# EasyEDA Pro project CameraTargetV1.eprj, schematic Schematic1
Create Date: 2023-02-02; Page Name: P1; Project Name: CameraTargetV1; Schematic Name: Schematic1; Update Date: 2023-06-21
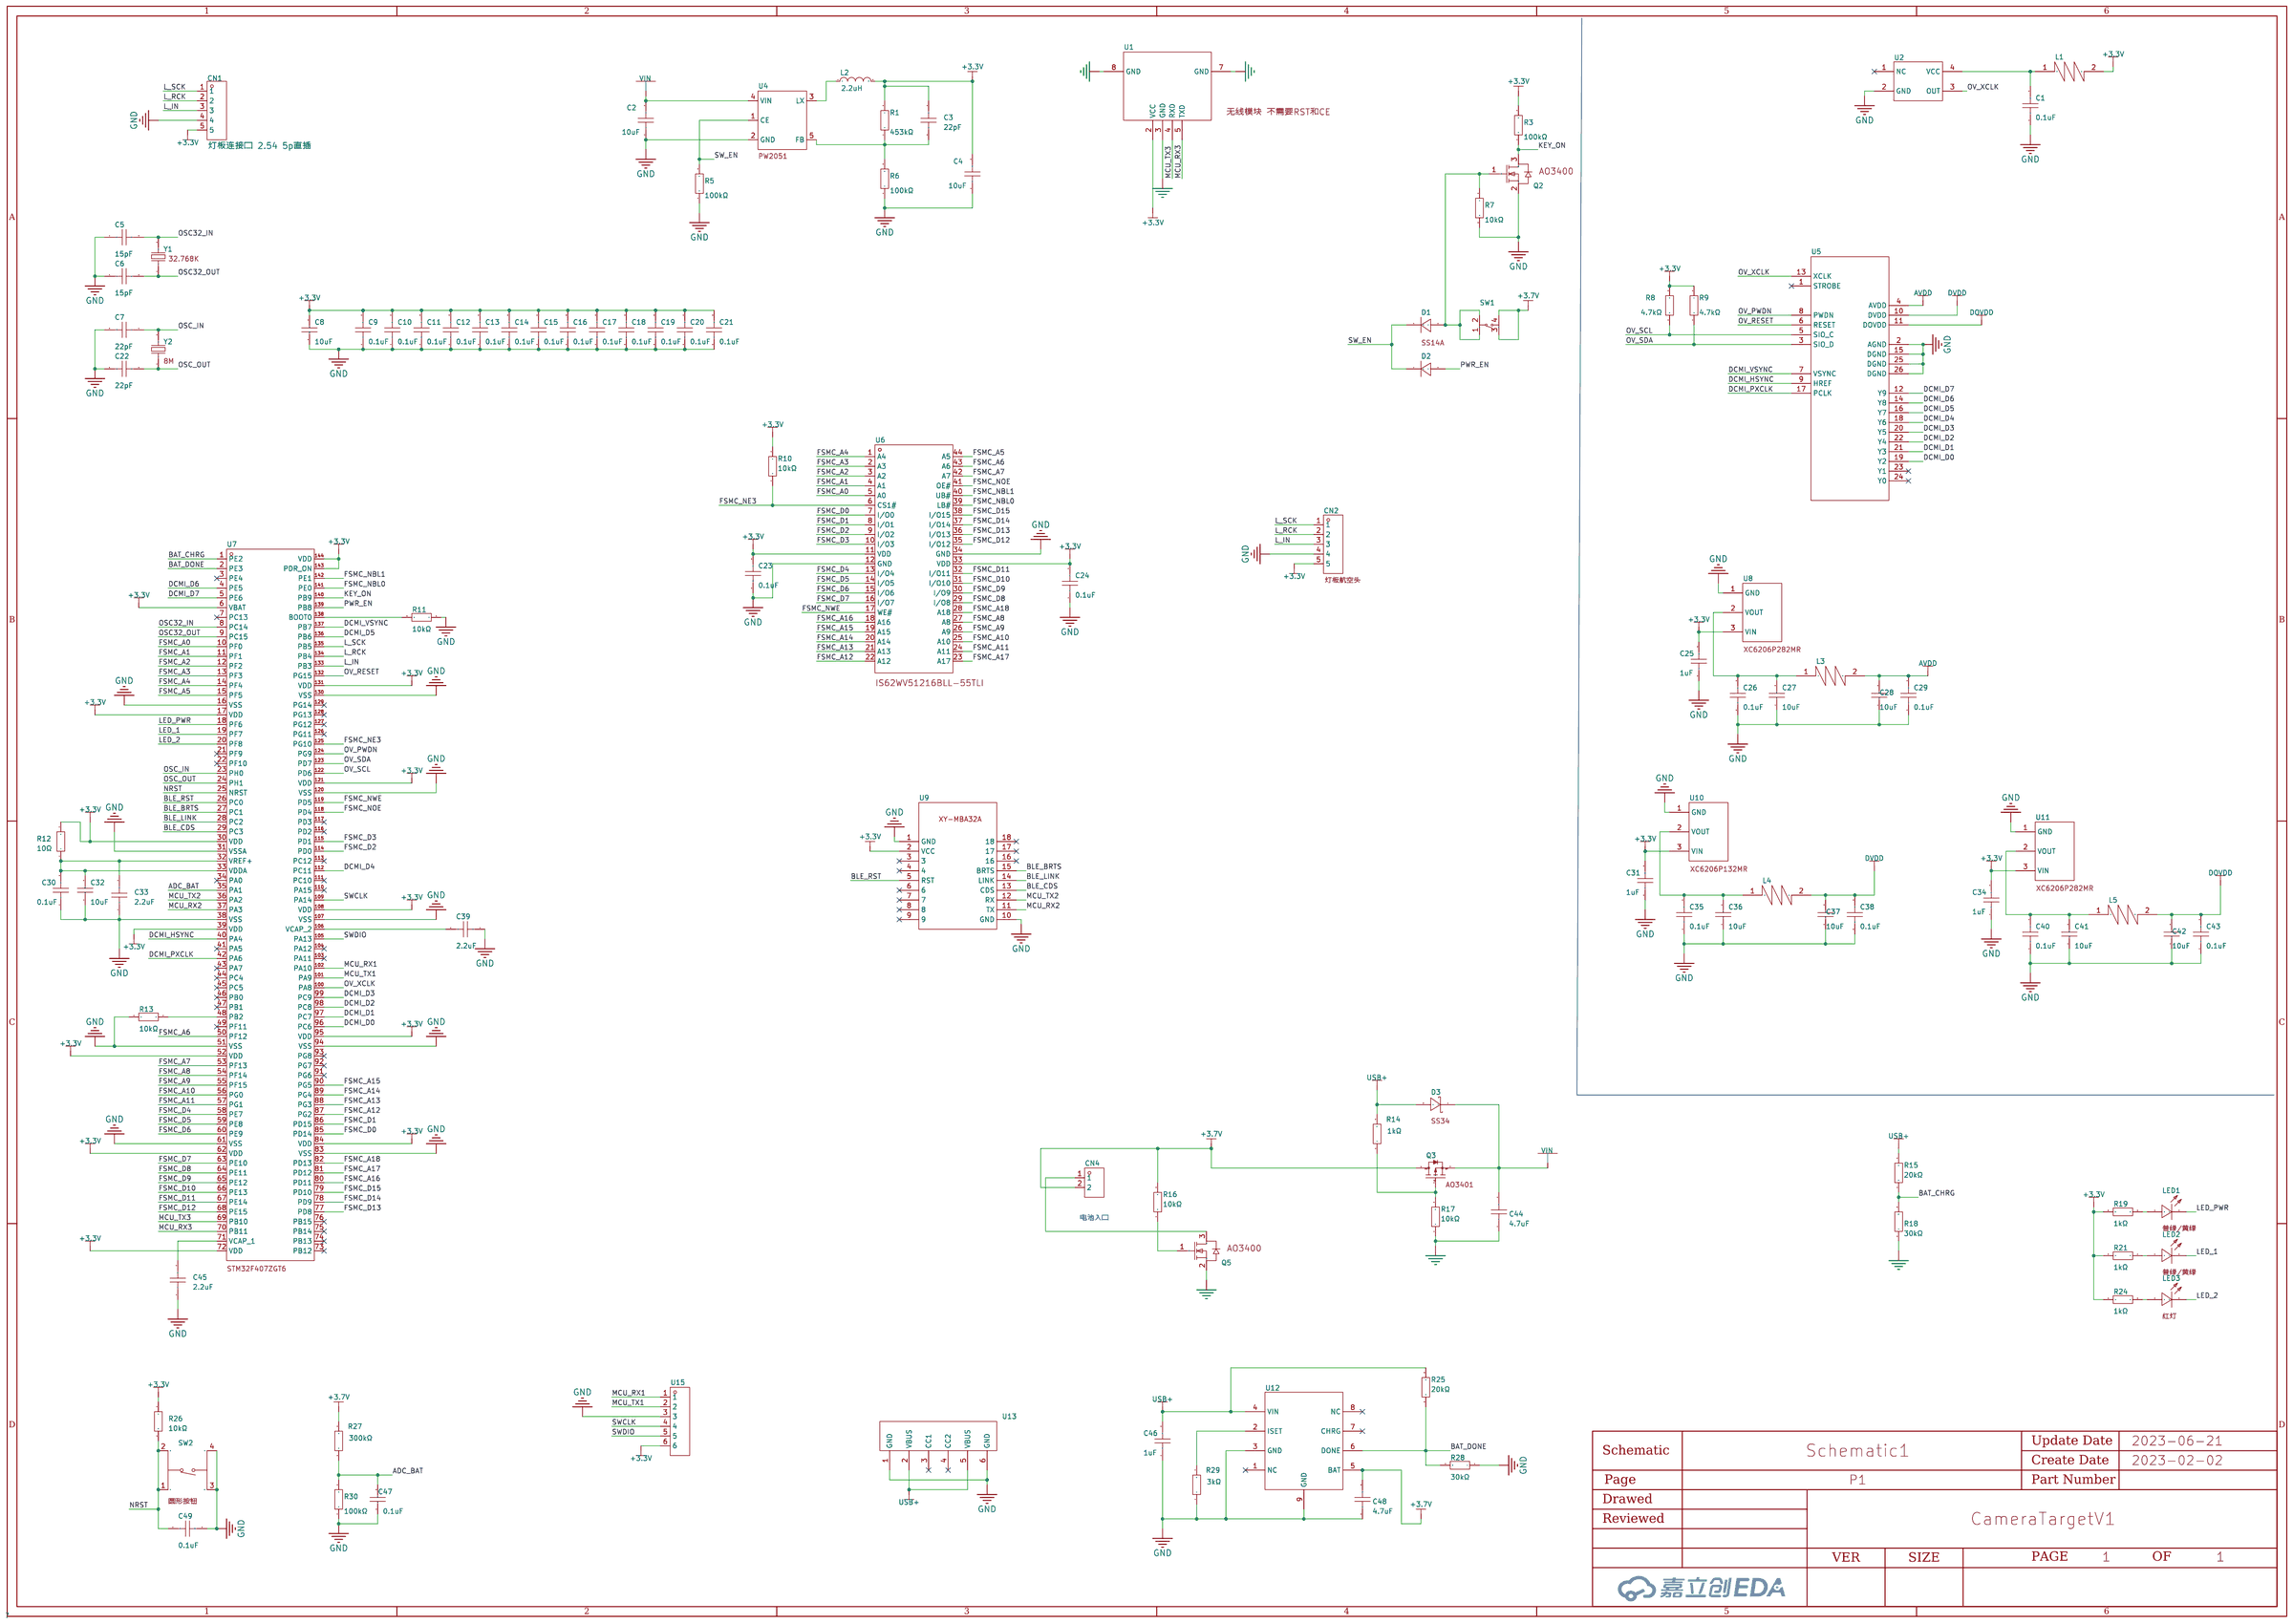
[diagram p0: schematic sheet]

## Parts
C1  0.1uF  [C0603]
C2  10uF  [C0603]
C3  22pF  [C0603]
C4  10uF  [C0603]
C5  15pF  [C0603]
C6  15pF  [C0603]
C7  22pF  [C0603]
C8  10uF  [C0603]
C9  0.1uF  [C0603]
C10  0.1uF  [C0603]
C11  0.1uF  [C0603]
C12  0.1uF  [C0603]
C13  0.1uF  [C0603]
C14  0.1uF  [C0603]
C15  0.1uF  [C0603]
C16  0.1uF  [C0603]
C17  0.1uF  [C0603]
C18  0.1uF  [C0603]
C19  0.1uF  [C0603]
C20  0.1uF  [C0603]
C21  0.1uF  [C0603]
C22  22pF  [C0603]
C23  0.1uF  [C0603]
C24  0.1uF  [C0603]
C25  1uF  [C0603]
C26  0.1uF  [C0603]
C27  10uF  [C0603]
C28  10uF  [C0603]
C29  0.1uF  [C0603]
C30  0.1uF  [C0603]
C31  1uF  [C0603]
C32  10uF  [C0603]
C33  2.2uF  [C0603]
C34  1uF  [C0603]
C35  0.1uF  [C0603]
C36  10uF  [C0603]
C37  10uF  [C0603]
C38  0.1uF  [C0603]
C39  2.2uF  [C0603]
C40  0.1uF  [C0603]
C41  10uF  [C0603]
C42  10uF  [C0603]
C43  0.1uF  [C0603]
C44  4.7uF  [C0603]
C45  2.2uF  [C0603]
C46  1uF  [C0603]
C47  0.1uF  [C0603]
C48  4.7uF  [C0603]
C49  0.1uF  [C0603]
CN1  灯板连接口 2.54 5p直插  [CONN-TH_5P-P2.50_HX25003-5A]
CN2  HDGC2501WR-5P  [CONN-TH_5P-P2.50_HDGC2501WR-5P]
CN4  HDGC2501WR-2P  [CONN-TH_2P-P2.50_HDGC2501WR-2P]
D1  SS14A  [SMA_L4.3-W2.6-LS5.2-RD]
D2  SS14A  [SMA_L4.3-W2.6-LS5.2-RD]
D3  -  [DO-214AC_L4.3-W2.7-LS5.3-RD]
L1  -  [0420]
L2  2.2uH  [IND-SMD_L4.0-W4.0_0.47UH04209.5A]
L3  -  [0420]
L4  -  [0420]
L5  -  [0420]
LED1  TLMG1100-GS08  [LED0603-R-RD_GREEN]
LED2  TLMG1100-GS08  [LED0603-R-RD_GREEN]
LED3  TLMS1000-GS08  [LED0603-R-RD]
Q2  AO3400  [SOT-23_L2.9-W1.3-P1.90-LS2.4-BR]
Q3  -  [SOT-23-3_L2.9-W1.3-P1.90-LS2.4-BR]
Q5  AO3400  [SOT-23_L2.9-W1.3-P1.90-LS2.4-BR]
R1  453kΩ  [R0603]
R3  100kΩ  [R0603]
R5  100kΩ  [R0603]
R6  100kΩ  [R0603]
R7  10kΩ  [R0603]
R8  4.7kΩ  [R0603]
R9  4.7kΩ  [R0603]
R10  10kΩ  [R0603]
R11  10kΩ  [R0603]
R12  10Ω  [R0603]
R13  10kΩ  [R0603]
R14  1kΩ  [R0603]
R15  20kΩ  [R0603]
R16  10kΩ  [R0603]
R17  10kΩ  [R0603]
R18  30kΩ  [R0603]
R19  1kΩ  [R0603]
R21  1kΩ  [R0603]
R24  1kΩ  [R0603]
R25  20kΩ  [R0603]
R26  10kΩ  [R0603]
R27  300kΩ  [R0603]
R28  30kΩ  [R0603]
R29  3kΩ  [R0603]
R30  100kΩ  [R0603]
SW1  -  [按钮开关]
SW2  1TS001G-2700-1500-CT  [SW-SMD_4P-L5.1-W5.1-P3.70-LS6.5-TL-2]
U1  -  [GC2400-TC010R]
U2  -  [5032-4P]
U4  -  [PW2051]
U5  -  [OV2640]
U6  IS62WV51216BLL-55TLI  [TSOP-44_L18.4-W10.2-P0.80-LS11.8-BL]
U7  STM32F407ZGT6  [LQFP-144_L20.0-W20.0-P0.50-LS22.0-BL]
U8  -  [SOT-23-3_L2.9-W1.6-P1.90-LS2.9-BL]
U9  -  [XY-MBA32A]
U10  -  [SOT-23-3_L2.9-W1.6-P1.90-LS2.9-BL]
U11  -  [SOT-23-3_L2.9-W1.6-P1.90-LS2.9-BL]
U12  -  [PW4056]
U13  -  [typec]
U15  HDGC1501WV-6P  [CONN-TH_6P-P1.50_HDGC_HDGC1501WV-6P]
Y1  -  [3215]
Y2  -  [5032]

## Library data of the parts
C1 C9-C21 C23 C24 C26 C29 C30 C35 C38 C40 C43 C49 = CC0603KRX7R9BB104: 容值:100nF;精度:±10%;额定电压:50V;材质(温度系数):X7R;; LCSC Part Name: 100nF ±10% 50V; Supplier Part: C14663; Manufacturer: YAGEO(国巨); Supplier Footprint: 0603; JLCPCB Part Class: Basic Part; Datasheet: https://atta.szlcsc.com/upload/public/pdf/source/20170116/1484561234239.pdf; Supplier: LCSC; Tolerance: ±10%; Voltage Rated: 50V; Temperature Coefficient: X7R
C2 C4 = 0603X106M100CT: 容值:10uF;精度:±20%;额定电压:10V;温度系数:X5R;; LCSC Part Name: 10uF ±20% 10V; Supplier Part: C89283; Manufacturer: 华新科(Walsin); Supplier Footprint: 0603; JLCPCB Part Class: Extended Part; Datasheet: https://atta.szlcsc.com/upload/public/pdf/source/20161226/1482720147964.pdf; Supplier: LCSC; Tolerance: ±20%; Voltage Rated: 10V; Temperature Coefficient: X5R
C3 C7 C22 = 0603CG220F500NT: 容值:22pF;精度:±1%;额定电压:50V;温度系数:C0G;; LCSC Part Name: 22pF ±1% 50V; Supplier Part: C190086; Manufacturer: FH(风华); Supplier Footprint: 0603; JLCPCB Part Class: Extended Part; Datasheet: https://atta.szlcsc.com/upload/public/pdf/source/20180403/C190086_AE2857A36C77ED36CE0DF753AD1C79C3.pdf; Supplier: LCSC; Tolerance: ±1%; Voltage Rated: 50V; Temperature Coefficient: C0G
C5 C6 = 0603CG150J500NT: 容值:15pF;精度:±5%;额定电压:50V;温度系数:C0G;; LCSC Part Name: 15pF ±5% 50V; Supplier Part: C91703; Manufacturer: FH(风华); Supplier Footprint: 0603; JLCPCB Part Class: Extended Part; Datasheet: https://atta.szlcsc.com/upload/public/pdf/source/20170105/1483610779016.pdf; Supplier: LCSC; Tolerance: ±5%; Voltage Rated: 50V; Temperature Coefficient: C0G
C8 C27 C28 C32 C36 C37 C41 C42 = 0603X106K160NT: 温度系数:X5R;精度:±10%;额定电压:16V;容值:10uF;; LCSC Part Name: 10uF(106) ±10% 16V; Supplier Part: C70225; Manufacturer: FH(风华); Supplier Footprint: 0603; JLCPCB Part Class: Extended Part; Datasheet: https://atta.szlcsc.com/upload/public/pdf/source/20170923/C70225_1506149537616988930.pdf; Supplier: LCSC; Temperature Coefficient: X5R; Tolerance: ±10%; Voltage Rated: 16V
C25 C31 C34 C46 = CC0603KRX7R9BB105: 容值:1uF;精度:±10%;额定电压:50V;材质(温度系数):X7R;; LCSC Part Name: 1uF ±10% 50V; Supplier Part: C559769; Manufacturer: YAGEO(国巨); Supplier Footprint: 0603; JLCPCB Part Class: Extended Part; Datasheet: https://atta.szlcsc.com/upload/public/pdf/source/20181031/C325451_C7CF01155AE3010E0D610C52F5FE7D31.pdf; Supplier: LCSC; Tolerance: ±10%; Voltage Rated: 50V; Temperature Coefficient: X7R
C33 C39 C45 = 0603B225K160CT: 容值:2.2uF;精度:±10%;额定电压:16V;温度系数:X7R;; LCSC Part Name: 2.2uF ±10% 16V; Supplier Part: C525501; Manufacturer: 华新科(Walsin); Supplier Footprint: 0603; JLCPCB Part Class: Extended Part; Datasheet: https://atta.szlcsc.com/upload/public/pdf/source/20191217/C469650_84AD5C6F618CF4AC0C6D987F2E8FE6F8.pdf; Supplier: LCSC; Tolerance: ±10%; Voltage Rated: 16V; Temperature Coefficient: X7R
C44 C48 = 0603X475M160NT: 容值:4.7uF;精度:±20%;额定电压:16V;温度系数:X5R;; LCSC Part Name: 4.7uF ±20% 16V; Supplier Part: C417282; Manufacturer: FH(风华); Supplier Footprint: 0603; JLCPCB Part Class: Extended Part; Datasheet: https://atta.szlcsc.com/upload/public/pdf/source/20190828/C417282_9FA89336CC150C49D68906F9E844F6E8.pdf; Supplier: LCSC; Tolerance: ±20%; Voltage Rated: 16V; Temperature Coefficient: X5R
C47 = 0603B104K101CT: 容值:100nF;精度:±10%;额定电压:100V;温度系数:X7R;; LCSC Part Name: 100nF ±10% 100V; Supplier Part: C116838; Manufacturer: 华新科(Walsin); Supplier Footprint: 0603; JLCPCB Part Class: Extended Part; Datasheet: https://atta.szlcsc.com/upload/public/pdf/source/20190709/C116838_F1A9F4B47B8E555AD45D8607B90A094B.pdf; Supplier: LCSC; Tolerance: ±10%; Voltage Rated: 100V; Temperature Coefficient: X7R
CN1 = HX25003-5A: 参考系列:XH;间距:2.5mm;插针结构:1x5P;排数:1;每排PIN数:5;行距:-;公母:公型插针;安装方式:直插;额定电流:-;工作温度范围:-;; LCSC Part Name: XH 2.5mm 1x5P 直插; Supplier Part: C442302; Manufacturer: HX(红星); Supplier Footprint: 插件,P=2.5mm; JLCPCB Part Class: Extended Part; Datasheet: https://atta.szlcsc.com/upload/public/pdf/source/20191028/C442302_E66AD84792E19526D7353D56EEE1C29F.pdf; Supplier: LCSC; Reference Series: XH; Pitch: 2.5mm; Pins Structure: 1x5P; Number of Rows: 1; Number of PINs Per Row: 5; Gender: 公型插针; Mounting Style: 直插
CN2 = HDGC2501WR-5P: 灯板航空头; LCSC Part Name: XH2.5弯针 5P; Supplier Part: C5175258; Manufacturer: HDGC(华德共创); Supplier Footprint: 弯插,P=2.5mm; Datasheet: https://atta.szlcsc.com/upload/public/pdf/source/20220916/5D6D01E77D919FBB15E2FEFFF7AE5019.pdf; Supplier: LCSC
CN4 = HDGC2501WR-2P: LCSC Part Name: XH2.5弯针 2P; Supplier Part: C5175255; Manufacturer: HDGC(华德共创); Supplier Footprint: 弯插,P=2.5mm; JLCPCB Part Class: Extended Part; Datasheet: https://atta.szlcsc.com/upload/public/pdf/source/20220916/C1717F8E2C78083BF9D63A459D48AEE1.pdf; Supplier: LCSC
D1 D2 = SS14A: 直流反向耐压(Vr):40V;平均整流电流(Io):1A;正向压降(Vf):500mV@1A;; LCSC Part Name: 40V 1A 500mV@1A; Supplier Part: C211770; Manufacturer: YANGJIE(扬杰); Supplier Footprint: SMA(DO-214AC); JLCPCB Part Class: Extended Part; Datasheet: https://atta.szlcsc.com/upload/public/pdf/source/20180504/C211770_627C435F34E9C107E4A4301F69D28675.pdf; Supplier: LCSC; Reverse Voltage (Vr): 40V; Average Rectified Current (Io): 1A; Forward Voltage (Vf@If): 500mV@1A
D3 = SS34_C8678: 直流反向耐压(Vr):40V;平均整流电流(Io):3A;正向压降(Vf):550mV@3A;; LCSC Part Name: 40V 3A 550mV@3A; Supplier Part: C8678; Manufacturer: MDD; Manufacturer Part: SS34; Supplier Footprint: SMA(DO-214AC); JLCPCB Part Class: Basic Part; Datasheet: https://atta.szlcsc.com/upload/public/pdf/source/20210506/C15874_5BDBC70F665BA444FCE0210303DB2A89.pdf; Supplier: LCSC; Reverse Voltage (Vr): 40V; Average Rectified Current (Io): 3A; Forward Voltage (Vf@If): 550mV@3A
L1 L3-L5 = 3.3uh电感
L2 = 2.2uh3a电感: 电感值:2.2uH;精度:±20%;额定电流:3A;直流电阻(DCR):-;; Rated Current: 3A; Supplier: LCSC; Supplier Part: C438930; Supplier Footprint: SMD; LCSC Part Name: 2.2uH ±20% 3A; Tolerance: ±20%; Manufacturer: Cybermax(思博科技); Manufacturer Part: CMLO0420H2R2MTT
LED1 LED2 = TLMG1100-GS08: 照明颜色:普绿/黄绿;色温 - CCT（K）:-;主波长/色坐标:570nm;; LCSC Part Name: 普绿/黄绿 0603; Supplier Part: C241891; Manufacturer: VISHAY(威世); Supplier Footprint: 0603; JLCPCB Part Class: Extended Part; Datasheet: https://atta.szlcsc.com/upload/public/pdf/source/20180719/C241891_3C76D4DD30CDE57601F75DEAAAECA69D.pdf; Supplier: LCSC; Mounting Type: 表面贴装; Illumination Color: 普绿/黄绿; Luminous Intensity (IF=20mA): 35mcd; Dominant Wavelength / Coordinate rank: 570nm
LED3 = TLMS1000-GS08: 发光颜色:红灯;; LCSC Part Name: 红灯; Supplier Part: C241893; Manufacturer: VISHAY(威世); Supplier Footprint: 0603; JLCPCB Part Class: Extended Part; Datasheet: https://atta.szlcsc.com/upload/public/pdf/source/20180719/C241893_4BC7C846B3C52AB2D39E337E84999DF0.pdf; Supplier: LCSC; Emitted Color: 红灯
Q2 Q5 = AO3400: 类型:N沟道;漏源电压(Vdss):30V;连续漏极电流(Id):5.8A;功率(Pd):1.5W;导通电阻(RDS(on)@Vgs,Id):35mΩ@10V,5.8A;阈值电压(Vgs(th)@Id):1.2V@250uA;栅极电荷(Qg@Vgs):-;输入电容(Ciss@Vds):1050pF@15V;反向传输电容(Crss@Vds):77pF@15V;工作温度:+150@(Tj);; LCSC Part Name: N沟道 30V 5.8A; Supplier Part: C2938367; Manufacturer: GOODWORK(固得沃克); Supplier Footprint: SOT23; JLCPCB Part Class: Extended Part; Datasheet: https://atta.szlcsc.com/upload/public/pdf/source/20211229/1DE691E24B5B31BB262C463D0489A9AB.pdf; Supplier: LCSC; Type: N沟道; Drain Source Voltage (Vdss): 30V; Continuous Drain Current (Id): 5.8A; Power Dissipation (Pd): 1.5W; Drain Source On Resistance (RDS(on)@Vgs,Id): 35mΩ@10V,5.8A; Gate Threshold Voltage (Vgs(th)@Id): 1.2V@250uA; Input Capacitance (Ciss@Vds): 1050pF@15V; Reverse Transfer Capacitance (Crss@Vds): 77pF@15V; Operating Temperature: +150@(Tj)
Q3 = AO3401_C181091: 类型:P沟道;漏源电压(Vdss):30V;连续漏极电流(Id):4.2A;功率(Pd):350mW;导通电阻(RDS(on)@Vgs,Id):65mΩ@10V,4.2A;阈值电压(Vgs(th)@Id):1.3V@250A;; LCSC Part Name: P沟道 30V 4.2A; Supplier Part: C181091; Manufacturer: Hottech(合科泰); Manufacturer Part: AO3401; Supplier Footprint: SOT-23(SOT-23-3); JLCPCB Part Class: Extended Part; Datasheet: https://atta.szlcsc.com/upload/public/pdf/source/20180131/C181091_15173931948391329220.pdf; Supplier: LCSC; Type: P沟道; Drain Source Voltage (Vdss): 30V; Continuous Drain Current (Id): 4.2A; Power Dissipation (Pd): 350mW; Drain Source On Resistance (RDS(on)@Vgs,Id): 65mΩ@10V,4.2A; Gate Threshold Voltage (Vgs(th)@Id): 1.3V@250A
R1 = 0603WAF4533T5E: 电阻类型:厚膜电阻;阻值:453kΩ;精度:±1%;功率:1/10W;温度系数:±100ppm/;最大工作电压:75V;工作温度范围:-55~+155;; LCSC Part Name: 453kΩ ±1%; Supplier Part: C25818; Manufacturer: UNI-ROYAL(厚声); Supplier Footprint: 0603; JLCPCB Part Class: Extended Part; Datasheet: https://atta.szlcsc.com/upload/public/pdf/source/20200306/C422600_1E6D84923E4A46A82E41ADD87F860B5C.pdf; Supplier: LCSC; Type: 厚膜电阻; Tolerance: ±1%; Power(Watts): 1/10W; Temperature Coefficient: ±100ppm/; Overload Voltage (Max): 75V; Operating Temperature Range: -55~+155
R3 R5 R6 R30 = MCT06030C1003FP500: 电阻类型:薄膜电阻;阻值:100kΩ;精度:±1%;功率:100mW;温度系数:±50ppm/K;最大工作电压:75V;工作温度范围:-55~+125;; LCSC Part Name: 100kΩ ±1%; Supplier Part: C161805; Manufacturer: VISHAY(威世); Supplier Footprint: 0603; JLCPCB Part Class: Extended Part; Datasheet: https://atta.szlcsc.com/upload/public/pdf/source/20180125/C161805_15168649470331302834.pdf; Supplier: LCSC; Type: 薄膜电阻; Tolerance: ±1%; Power(Watts): 100mW; Temperature Coefficient: ±50ppm/K; Overload Voltage (Max): 75V; Operating Temperature Range: -55~+125
R7 R10 R11 R13 R16 R17 R26 = SY0603JN10KP: 阻值:10kΩ;精度:±5%;功率:1/16W;温度系数:±100ppm/;; LCSC Part Name: 10kΩ ±5%; Supplier Part: C380762; Manufacturer: SANYEAR(叁叶源); Supplier Footprint: 0603; JLCPCB Part Class: Extended Part; Datasheet: https://atta.szlcsc.com/upload/public/pdf/source/20190402/C380762_D09B63EB8DF4AE0F44268631C04132BC.pdf; Supplier: LCSC; Tolerance: ±5%; Power(Watts): 1/16W; Temperature Coefficient: ±100ppm/
R8 R9 = RC0603FR-074K7L: 阻值:4.7kΩ;精度:±1%;功率:100mW;温度系数:±100ppm/;最大工作电压:75V;工作温度范围:-55~+155;; LCSC Part Name: 4.7kΩ ±1% 100mW; Supplier Part: C99782; Manufacturer: YAGEO(国巨); Supplier Footprint: 0603; JLCPCB Part Class: Extended Part; Datasheet: https://atta.szlcsc.com/upload/public/pdf/source/20171030/C99782_15093665213961068236.pdf; Supplier: LCSC; Tolerance: ±1%; Power(Watts): 100mW; Temperature Coefficient: ±100ppm/; Overload Voltage (Max): 75V; Operating Temperature Range: -55~+155
R12 = 0603WAF100JT5E: 电阻类型:厚膜电阻;阻值:10Ω;精度:±1%;功率:100mW;温度系数:±400ppm/;最大工作电压:75V;工作温度范围:-55~+155;; LCSC Part Name: 10Ω ±1% 100mW; Supplier Part: C22859; Manufacturer: UNI-ROYAL(厚声); Supplier Footprint: 0603; JLCPCB Part Class: Basic Part; Datasheet: https://atta.szlcsc.com/upload/public/pdf/source/20200306/C422600_1E6D84923E4A46A82E41ADD87F860B5C.pdf; Supplier: LCSC; Type: 厚膜电阻; Tolerance: ±1%; Power(Watts): 100mW; Temperature Coefficient: ±400ppm/; Overload Voltage (Max): 75V; Operating Temperature Range: -55~+155
R14 R19 R21 R24 = TR0603B1K00P0525Z: 电阻类型:薄膜电阻;阻值:1kΩ;精度:±0.1%;功率:100mW;温度系数:±25ppm/;最大工作电压:75V;工作温度范围:-55~+155;; LCSC Part Name: 1kΩ ±0.1%; Supplier Part: C188364; Manufacturer: EVER OHMS(天二科技); Supplier Footprint: 0603; JLCPCB Part Class: Extended Part; Datasheet: https://atta.szlcsc.com/upload/public/pdf/source/20190415/C188364_2560310032FA915A7069B8237DA8774F.pdf; Supplier: LCSC; Type: 薄膜电阻; Tolerance: ±0.1%; Power(Watts): 100mW; Temperature Coefficient: ±25ppm/; Overload Voltage (Max): 75V; Operating Temperature Range: -55~+155
R15 R25 = RC0603DR-0720KL: 电阻类型:厚膜电阻;阻值:20kΩ;精度:±0.5%;功率:100mW;温度系数:±100ppm/;最大工作电压:75V;工作温度范围:-55~+155;; LCSC Part Name: 20kΩ ±0.5%; Supplier Part: C137817; Manufacturer: YAGEO(国巨); Supplier Footprint: 0603; JLCPCB Part Class: Extended Part; Datasheet: https://atta.szlcsc.com/upload/public/pdf/source/20171106/C137817_15099606819651093946.pdf; Supplier: LCSC; Type: 厚膜电阻; Tolerance: ±0.5%; Power(Watts): 100mW; Temperature Coefficient: ±100ppm/; Overload Voltage (Max): 75V; Operating Temperature Range: -55~+155
R18 R28 = AC0603FR-0730KL: 电阻类型:厚膜电阻;阻值:30kΩ;精度:±1%;功率:100mW;温度系数:±100ppm/;最大工作电压:75V;工作温度范围:-55~+155;; LCSC Part Name: 30kΩ ±1%; Supplier Part: C144670; Manufacturer: YAGEO(国巨); Supplier Footprint: 0603; JLCPCB Part Class: Extended Part; Datasheet: https://atta.szlcsc.com/upload/public/pdf/source/20171225/C144670_15141880418861202957.pdf; Supplier: LCSC; Type: 厚膜电阻; Tolerance: ±1%; Power(Watts): 100mW; Temperature Coefficient: ±100ppm/; Overload Voltage (Max): 75V; Operating Temperature Range: -55~+155
R27 = RC0603FR-07300KL: 阻值:300kΩ;精度:±1%;功率:100mW;温度系数:±100ppm/;最大工作电压:75V;工作温度范围:-55~+155;; LCSC Part Name: 300kΩ ±1%; Supplier Part: C114667; Manufacturer: YAGEO(国巨); Supplier Footprint: 0603; JLCPCB Part Class: Extended Part; Datasheet: https://atta.szlcsc.com/upload/public/pdf/source/20170818/C114667_1503051153004895128.pdf; Supplier: LCSC; Tolerance: ±1%; Power(Watts): 100mW; Temperature Coefficient: ±100ppm/; Overload Voltage (Max): 75V; Operating Temperature Range: -55~+155
R29 = 0603WAJ0302T5E: 电阻类型:厚膜电阻;阻值:3kΩ;精度:±5%;功率:1/10W;温度系数:±100ppm/;最大工作电压:75V;工作温度范围:-55~+155;; LCSC Part Name: 3kΩ ±5%; Supplier Part: C25597; Manufacturer: UNI-ROYAL(厚声); Supplier Footprint: 0603; JLCPCB Part Class: Extended Part; Datasheet: https://atta.szlcsc.com/upload/public/pdf/source/20200306/C422600_1E6D84923E4A46A82E41ADD87F860B5C.pdf; Supplier: LCSC; Type: 厚膜电阻; Tolerance: ±5%; Power(Watts): 1/10W; Temperature Coefficient: ±100ppm/; Overload Voltage (Max): 75V; Operating Temperature Range: -55~+155
SW1 = 按键开关
SW2 = 1TS001G-2700-1500-CT: 触点电流:20mA;额定电压(DC):12V;电路结构:单刀单掷;安装方式:立贴;按钮形状:圆形按钮;带灯:-;开关长度:5.1mm;开关宽度:5.1mm;开关高度:0.3mm;; LCSC Part Name: 铜头按钮; Supplier Part: C318800; Manufacturer: HYP(鸿源精密); Supplier Footprint: SMD,5.1x5.1mm; JLCPCB Part Class: Extended Part; Datasheet: https://atta.szlcsc.com/upload/public/pdf/source/20200109/C318800_E3EE45BECD3EEEC6701309AC007B685B.pdf; Supplier: LCSC; Contact Current: 20mA; Voltage Rating (DC): 12V; Circuit: 单刀单掷; Mounting Style: 立贴; Actuator Style: 圆形按钮; Switch Length: 5.1mm; Switch Width: 5.1mm; Switch Height: 0.3mm
U1 = GC2400-TC010R: 无线模块 不需要RST和CE; NO_CONNECT: yes
U2 = 24M有源晶振
U4 = PW2051: Supplier: LCSC; Supplier Part: C9900004763; Supplier Footprint: SOT23-5; JLCPCB Part Class: Extended Part; Datasheet: 2021-12-24/856123Z/fbe1facec1e64a42b88c21fe7c936e8d/PW2051.pdf
U5 = 相机排座: NO_CONNECT: yes
U6 = IS62WV51216BLL-55TLI: 8-Mbit(512K  16bit)，并行接口，工作电压：2.5V to 3.6V; Supplier Part: C11315; Manufacturer: ISSI(美国芯成); Supplier Footprint: TSOP-44-10.2mm; JLCPCB Part Class: Extended Part; Datasheet: https://atta.szlcsc.com/upload/public/pdf/source/20130225/1457706593006.pdf; Supplier: LCSC
U7 = STM32F407ZGT6: CPU内核:ARM Cortex-M4;CPU最大主频:168MHz;工作电压范围:1.8V~3.6V;内部振荡器:有;程序 FLASH容量:1MB;RAM总容量:192KB;EEPROM/数据 FLASH容量:-;GPIO端口数量:114;ADC(单元数/通道数/位数):1@x24ch/12bit;DAC(单元数/通道数/位数):1@x2ch/12bit;外设/功能/协议栈:欠压检测/复位；DMA；LCD驱动；看门狗；POR；PWM;工作温度范围:-40~+85;; LCSC Part Name: ARM Cortex-M4 168MHz 闪存：1MB RAM：192KB; Supplier Part: C19156; Manufacturer: ST(意法半导体); Supplier Footprint: LQFP-144(20x20); JLCPCB Part Class: Extended Part; Datasheet: https://atta.szlcsc.com/upload/public/pdf/source/20140724/1457707162528.pdf; Supplier: LCSC; CPU Core: ARM Cortex-M4; Maximum Frequency: 168MHz; Supply Voltage Range: 1.8V~3.6V; Internal Oscillator: 有; Program FLASH Size: 1MB; RAM Size: 192KB; GPIO Ports Number: 114; ADC (Units/Channels/bits): 1@x24ch/12bit; DAC (Units/Channels/bits): 1@x2ch/12bit; Peripherals / Functions / Protocol Stacks: 欠压检测/复位；DMA；LCD驱动；看门狗；POR；PWM; Operating Temperature Range: -40~+85
U8 U11 = 电压芯片共用: XC6206P282MR
U9 = XY-MBA32A: 蓝牙5.2
U10 = 电压芯片共用: XC6206P132MR
U12 = PW4056: 带OVP充电芯片
U13 = typec: type c接口
U15 = HDGC1501WV-6P: LCSC Part Name: ZH1.5直针 6P; Supplier Part: C5175216; Manufacturer: HDGC(华德共创); Supplier Footprint: 直插,P=1.5mm; Datasheet: https://atta.szlcsc.com/upload/public/pdf/source/20220916/0E4647A3A85E9D7CFB69507DE86E8F95.pdf; Supplier: LCSC
Y1 = 32.768KHz晶振: 32.768K
Y2 = 8MHz晶振: 8M

## Nets
+3.3V: C3.1 C4.2 C8.2 C9.2 C10.2 C11.2 C12.2 C13.2 C14.2 C15.2 C16.2 C17.2 C18.2 C19.2 C20.2 C21.2 C23.2 C24.2 C25.2 C31.2 C34.2 CN1.5 CN2.5 L1.2 L2.2 R1.2 R3.2 R8.2 R9.2 R10.2 R12.2 R19.2 R21.2 R24.2 R26.1 U1.2(VCC) U6.11(VDD) U6.33(VDD) U7.6(VBAT) U7.17(VDD) U7.30(VDD) U7.39(VDD) U7.52(VDD) U7.62(VDD) U7.72(VDD) U7.84(VDD) U7.95(VDD) U7.108(VDD) U7.121(VDD) U7.131(VDD) U7.143(PDR_ON) U7.144(VDD) U8.3(VIN) U9.2(VCC) U10.3(VIN) U11.3(VIN) U15.6
+3.7V: C48.2 CN4.2 Q3.3(D) R16.2 R27.2 SW1.3(C) SW1.4(D) U12.5(BAT)
AVDD: C28.2 C29.2 L3.2 U5.4(AVDD)
DVDD: C37.2 C38.2 L4.2 U5.10(DVDD)
GND: C1.1 C2.1 C4.1 C5.1 C6.1 C7.2 C8.1 C9.1 C10.1 C11.1 C12.1 C13.1 C14.1 C15.1 C16.1 C17.1 C18.1 C19.1 C20.1 C21.1 C22.2 C23.1 C24.1 C25.1 C26.1 C27.1 C28.1 C29.1 C30.1 C31.1 C32.1 C33.1 C34.1 C35.1 C36.1 C37.1 C38.1 C39.1 C40.1 C41.1 C42.1 C43.1 C44.1 C45.1 C46.1 C47.1 C48.1 C49.1 CN1.4 CN2.4 Q2.2(S) Q5.2(S) R5.1 R6.1 R7.2 R11.1 R13.2 R17.1 R18.1 R28.1 R29.1 R30.1 SW2.3(C) SW2.4(D) U1.3(GND) U1.7(GND) U1.8(GND) U2.2(GND) U4.2(GND) U5.2(AGND) U5.15(DGND) U5.25(DGND) U5.26(DGND) U6.12(GND) U6.34(GND) U7.16(VSS) U7.31(VSSA) U7.38(VSS) U7.51(VSS) U7.61(VSS) U7.83(VSS) U7.94(VSS) U7.107(VSS) U7.120(VSS) U7.130(VSS) U8.1(GND) U9.1(GND) U9.10(GND) U10.1(GND) U11.1(GND) U12.3(GND) U12.9(GND) U13.1(GND) U13.6(GND) U15.3
VIN: C2.2 C44.2 D3.1(K) Q3.2(S) U4.4(VIN)
ADC_BAT: C47.2 R27.1 R30.2 U7.35(PA1)
BAT_CHRG: R15.1 R18.2 U7.1(PE2)
BAT_DONE: R25.1 R28.2 U7.2(PE3) U12.6(DONE)
BLE_BRTS: U7.27(PC1) U9.15(BRTS)
BLE_CDS: U7.29(PC3) U9.13(CDS)
BLE_LINK: U7.28(PC2) U9.14(LINK)
BLE_RST: U7.26(PC0) U9.5(RST)
DCMI_D0: U5.19(Y2) U7.96(PC6)
DCMI_D1: U5.21(Y3) U7.97(PC7)
DCMI_D2: U5.22(Y4) U7.98(PC8)
DCMI_D3: U5.20(Y5) U7.99(PC9)
DCMI_D4: U5.18(Y6) U7.112(PC11)
DCMI_D5: U5.16(Y7) U7.136(PB6)
DCMI_D6: U5.14(Y8) U7.4(PE5)
DCMI_D7: U5.12(Y9) U7.5(PE6)
DCMI_HSYNC: U5.9(HREF) U7.40(PA4)
DCMI_PXCLK: U5.17(PCLK) U7.42(PA6)
DCMI_VSYNC: U5.7(VSYNC) U7.137(PB7)
DOVDD: C42.2 C43.2 L5.2 U5.11(DOVDD)
FSMC_A0: U6.5(A0) U7.10(PF0)
FSMC_A1: U6.4(A1) U7.11(PF1)
FSMC_A2: U6.3(A2) U7.12(PF2)
FSMC_A3: U6.2(A3) U7.13(PF3)
FSMC_A4: U6.1(A4) U7.14(PF4)
FSMC_A5: U6.44(A5) U7.15(PF5)
FSMC_A6: U6.43(A6) U7.50(PF12)
FSMC_A7: U6.42(A7) U7.53(PF13)
FSMC_A8: U6.27(A8) U7.54(PF14)
FSMC_A9: U6.26(A9) U7.55(PF15)
FSMC_A10: U6.25(A10) U7.56(PG0)
FSMC_A11: U6.24(A11) U7.57(PG1)
FSMC_A12: U6.22(A12) U7.87(PG2)
FSMC_A13: U6.21(A13) U7.88(PG3)
FSMC_A14: U6.20(A14) U7.89(PG4)
FSMC_A15: U6.19(A15) U7.90(PG5)
FSMC_A16: U6.18(A16) U7.80(PD11)
FSMC_A17: U6.23(A17) U7.81(PD12)
FSMC_A18: U6.28(A18) U7.82(PD13)
FSMC_D0: U6.7(I/O0) U7.85(PD14)
FSMC_D1: U6.8(I/O1) U7.86(PD15)
FSMC_D2: U6.9(I/O2) U7.114(PD0)
FSMC_D3: U6.10(I/O3) U7.115(PD1)
FSMC_D4: U6.13(I/O4) U7.58(PE7)
FSMC_D5: U6.14(I/O5) U7.59(PE8)
FSMC_D6: U6.15(I/O6) U7.60(PE9)
FSMC_D7: U6.16(I/O7) U7.63(PE10)
FSMC_D8: U6.29(I/O8) U7.64(PE11)
FSMC_D9: U6.30(I/O9) U7.65(PE12)
FSMC_D10: U6.31(I/O10) U7.66(PE13)
FSMC_D11: U6.32(I/O11) U7.67(PE14)
FSMC_D12: U6.35(I/O12) U7.68(PE15)
FSMC_D13: U6.36(I/O13) U7.77(PD8)
FSMC_D14: U6.37(I/O14) U7.78(PD9)
FSMC_D15: U6.38(I/O15) U7.79(PD10)
FSMC_NBL0: U6.39(LB#) U7.141(PE0)
FSMC_NBL1: U6.40(UB#) U7.142(PE1)
FSMC_NE3: R10.1 U6.6(CS1#) U7.125(PG10)
FSMC_NOE: U6.41(OE#) U7.118(PD4)
FSMC_NWE: U6.17(WE#) U7.119(PD5)
KEY_ON: Q2.3(D) R3.1 U7.140(PB9)
L_IN: CN1.3 CN2.3 U7.133(PB3)
L_RCK: CN1.2 CN2.2 U7.134(PB4)
L_SCK: CN1.1 CN2.1 U7.135(PB5)
LED_1: LED2.2(K) U7.19(PF7)
LED_2: LED3.2(K) U7.20(PF8)
LED_PWR: LED1.2(K) U7.18(PF6)
MCU_RX1: U7.102(PA10) U15.1
MCU_RX2: U7.37(PA3) U9.11(TX)
MCU_RX3: U1.5(TXD) U7.70(PB11)
MCU_TX1: U7.101(PA9) U15.2
MCU_TX2: U7.36(PA2) U9.12(RX)
MCU_TX3: U1.4(RXD) U7.69(PB10)
NRST: C49.2 R26.2 SW2.1(A) SW2.2(B) U7.25(NRST)
OSC32_IN: C5.2 U7.8(PC14) Y1.2
OSC32_OUT: C6.2 U7.9(PC15) Y1.1
OSC_IN: C7.1 U7.23(PH0) Y2.2
OSC_OUT: C22.1 U7.24(PH1) Y2.1
OV_PWDN: U5.8(PWDN) U7.124(PG9)
OV_RESET: U5.6(RESET) U7.132(PG15)
OV_SCL: R8.1 U5.5(SIO_C) U7.122(PD6)
OV_SDA: R9.1 U5.3(SIO_D) U7.123(PD7)
OV_XCLK: U2.3(OUT) U5.13(XCLK) U7.100(PA8)
PWR_EN: D2.2(A) U7.139(PB8)
SW_EN: D1.1(C) D2.1(C) R5.2 U4.1(CE)
SWCLK: U7.109(PA14) U15.4
SWDIO: U7.105(PA13) U15.5
USB+: C46.2 D3.2(A) R14.2 R15.2 R25.2 U12.4(VIN) U13.2(VBUS) U13.5(VBUS)
$1N11070: C1.2 L1.1 U2.4(VCC)
$1N20605: C30.2 C32.2 C33.2 R12.1 U7.32(VREF+) U7.33(VDDA)
$1N21732: C45.2 U7.71(VCAP_1)
$1N22015: C39.2 U7.106(VCAP_2)
$1N22293: R11.2 U7.138(BOOT0)
$1N22641: R13.1 U7.48(PB2)
$1N49914: R29.2 U12.2(ISET)
$1N58921: LED1.1(A) R19.1
$1N63388: LED2.1(A) R21.1
$1N63497: LED3.1(A) R24.1
$1N121900: C26.2 C27.2 L3.1 U8.2(VOUT)
$1N139219: Q3.1(G) R14.1 R17.2
$1N139221: Q5.1(G) R16.1
$1N139226: CN4.1 Q5.3(D)
$1N141101: L2.1 U4.3(LX)
$1N141104: C3.2 R1.1 R6.2 U4.5(FB)
$1N161989: D1.2(A) Q2.1(G) R7.1 SW1.1(A) SW1.2(B)
$1N166238: C35.2 C36.2 L4.1 U10.2(VOUT)
$1N167422: C40.2 C41.2 L5.1 U11.2(VOUT)

Not connected (* = marked no-connect by the designer): U2 1(NC)*; U5 1(STROBE)* 23(Y1)* 24(Y0)*; U7 3(PE4)* 7(PC13)* 21(PF9)* 22(PF10)* 34(PA0)* 41(PA5)* 43(PA7)* 44(PC4)* 45(PC5)* 46(PB0)* 47(PB1)* 49(PF11)* 73(PB12)* 74(PB13)* 75(PB14)* 76(PB15)* 91(PG6)* 92(PG7)* 93(PG8)* 103(PA11)* 104(PA12)* 110(PA15)* 111(PC10)* 113(PC12)* 116(PD2)* 117(PD3)* 126(PG11)* 127(PG12)* 128(PG13)* 129(PG14)*; U9 3* 4* 6* 7* 8* 9* 16* 17* 18*; U12 1(NC)* 7(CHRG)* 8(NC)*; U13 3(CC1)* 4(CC2)*

## Notes on the sheet
- 电池入口
